# Altium schematic sheet MicroController.SchDoc
size A4; SheetNumber: 3; SheetTotal: 3
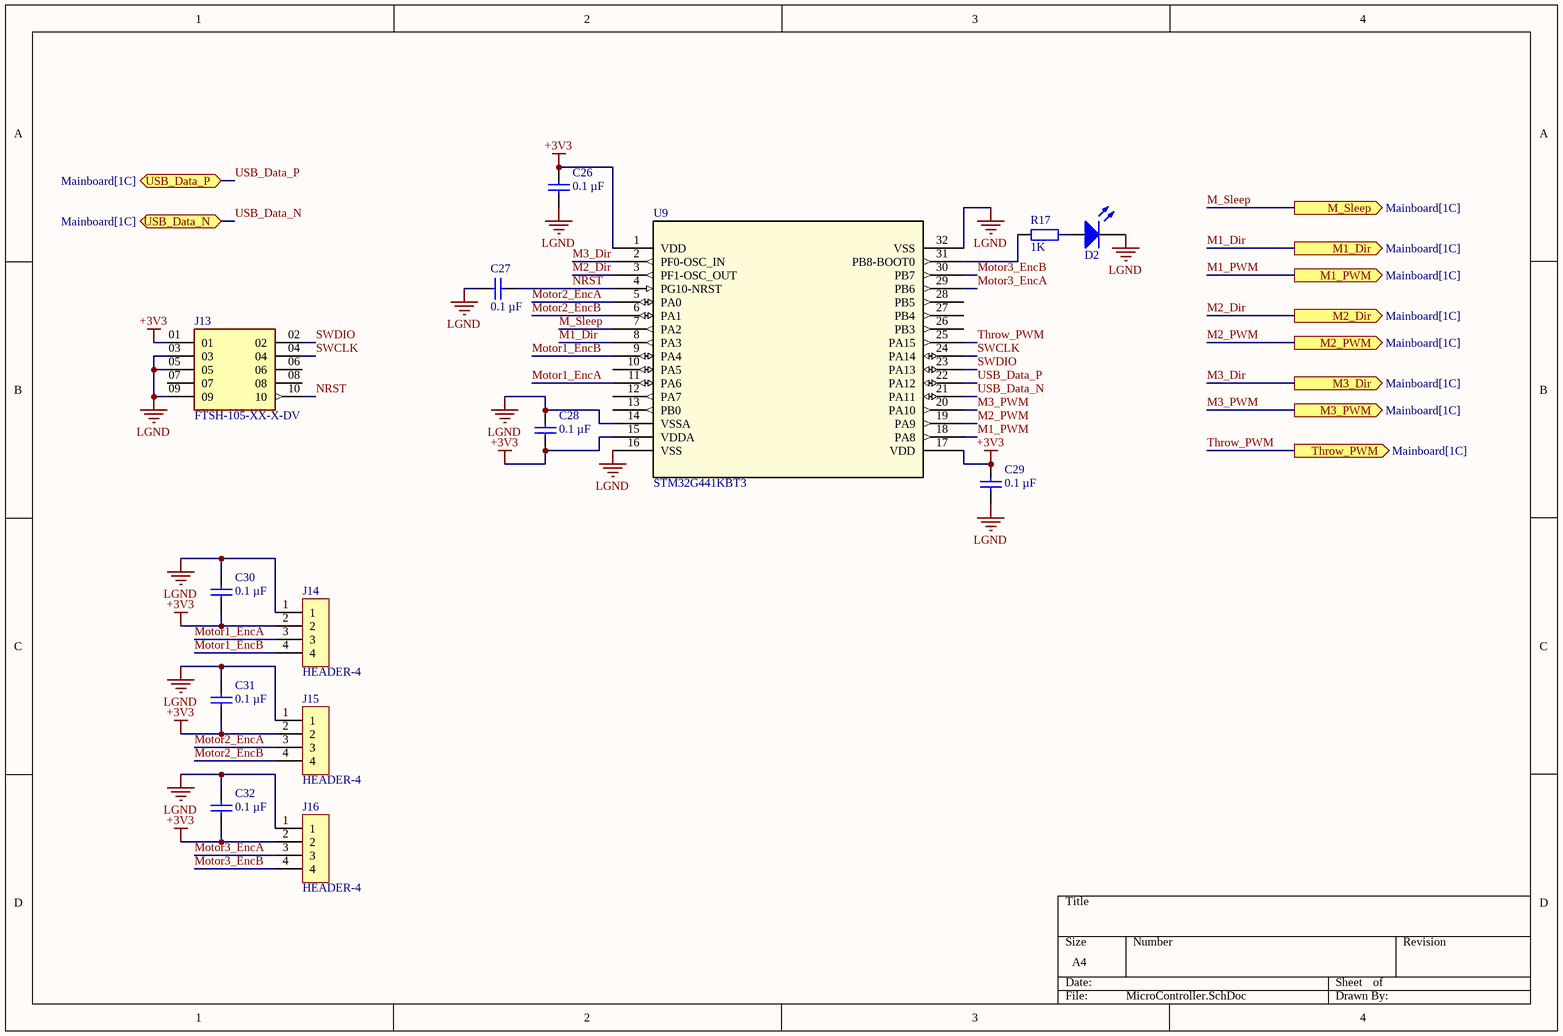
[diagram p0: MicroController.SchDoc]

## Parts
C26  value 0.1 µF  [CAP_0603]  (hidden comment: MLCC)
C27  value 0.1 µF  [CAP_0603]  (hidden comment: MLCC)
C28  value 0.1 µF  [CAP_0603]  (hidden comment: MLCC)
C29  value 0.1 µF  [CAP_0603]  (hidden comment: MLCC)
C30  value 0.1 µF  [CAP_0603]  (hidden comment: MLCC)
C31  value 0.1 µF  [CAP_0603]  (hidden comment: MLCC)
C32  value 0.1 µF  [CAP_0603]  (hidden comment: MLCC)
D2  LED  [0603_GREEN]  (value not drawn)
J13  FTSH-105-XX-X-DV  [SAMTEC_FTSH-105-XX-X-DV]
J14  HEADER-4  [MICRO-MATCH-FOB-04]
J15  HEADER-4  [MICRO-MATCH-FOB-04]
J16  HEADER-4  [MICRO-MATCH-FOB-04]
R17  value 1K  [RC0603N]  (hidden comment: RES)
U9  STM32G441KBT3  [LQFP32_7X7_STM]

## Ports
M1_Dir (out, see Mainboard[1C]), M1_PWM (out, see Mainboard[1C]), M2_Dir (out, see Mainboard[1C]), M2_PWM (out, see Mainboard[1C]), M3_Dir (out, see Mainboard[1C]), M3_PWM (out, see Mainboard[1C]), M_Sleep (out, see Mainboard[1C]), Throw_PWM (out, see Mainboard[1C]), USB_Data_N (bidir, see Mainboard[1C]), USB_Data_P (bidir, see Mainboard[1C])

## Nets
+3V3: C26.2 C28.1 C29.2 C30.1 C31.1 C32.1 J13.01 J14.2 J15.2 J16.2 U9.1(VDD) U9.15(VDDA) U9.17(VDD)
LGND: C26.1 C27.2 C28.2 C29.1 C30.2 C31.2 C32.2 D2.2(K) J13.03 J13.05 J13.09 J14.1 J15.1 J16.1 U9.14(VSSA) U9.16(VSS) U9.32(VSS)
M1_Dir: U9.8(PA3) ; port M1_Dir
M1_PWM: U9.18(PA8) ; port M1_PWM
M2_Dir: U9.3(PF1-OSC_OUT) ; port M2_Dir
M2_PWM: U9.19(PA9) ; port M2_PWM
M3_Dir: U9.2(PF0-OSC_IN) ; port M3_Dir
M3_PWM: U9.20(PA10) ; port M3_PWM
M_Sleep: U9.7(PA2) ; port M_Sleep
Motor1_EncA: J14.3 U9.11(PA6)
Motor1_EncB: J14.4 U9.9(PA4)
Motor2_EncA: J15.3 U9.5(PA0)
Motor2_EncB: J15.4 U9.6(PA1)
Motor3_EncA: J16.3 U9.29(PB6)
Motor3_EncB: J16.4 U9.30(PB7)
NRST: C27.1 J13.10 U9.4(PG10-NRST)
SWCLK: J13.04 U9.24(PA14)
SWDIO: J13.02 U9.23(PA13)
Throw_PWM: U9.25(PA15) ; port Throw_PWM
USB_Data_N: U9.21(PA11) ; port USB_Data_N
USB_Data_P: U9.22(PA12) ; port USB_Data_P
NetD2_1: D2.1(A) R17.1
NetR17_2: R17.2 U9.31(PB8-BOOT0)

Not connected (* = marked no-connect by the designer): J13 06 07 08; U9 10(PA5) 12(PA7) 13(PB0) 26(PB3) 27(PB4) 28(PB5)

## Library data of the parts
C26-C32 = CMP-059-000002-1: Multilayer Ceramic Capacitors; Tolerance: 10%; VoltageRatingDC: 5V; Component Type: Standard; Design Item ID: MLCC; Pin Count: 2; Source: Capacitors.SchLib
D2 = CMP-063-000000-1: LED Emitters; ForwardVoltage: 2V; Design Item ID: LED; Source: Leds.SchLib; Pin Count: 2; Component Type: Standard
J13 = CMP-004-000000-2: Connector Header Surface Mount 10 position 0.050" (1.27mm); Package: None; Component Type: Standard; Pin Count: 10; Availability: Unavailable; Value: *; Price: None; Source: FTSH-105-XX-X-DV.SchLib; Design Item ID: FTSH-105-XX-X-DV; MP: FTSH-105-XX-X-DV
J14-J16 = CMP-051-000006-1: Design Item ID: HEADER-4; Component Type: Standard; Source: connectors_micromatch.SchLib; Pin Count: 4
R17 = CMP-061-000001-5: Chip Resistors; PowerRating: 0.25W; Component Type: Standard; Source: Resistors.SchLib; Pin Count: 2; Design Item ID: RES
U9 = STM32G441KBT3: No Description Available; Mfr_Name: STMicroelectronics; Copyright: Copyright (C) 2022 Ultra Librarian. All rights reserved.; Manufacturer_Part_Number: STM32G441KBT3; RefDes: RefDes; Type: DEV